# EAGLE schematic MPU-6050-HMC-5883 (EAGLE 6.2)
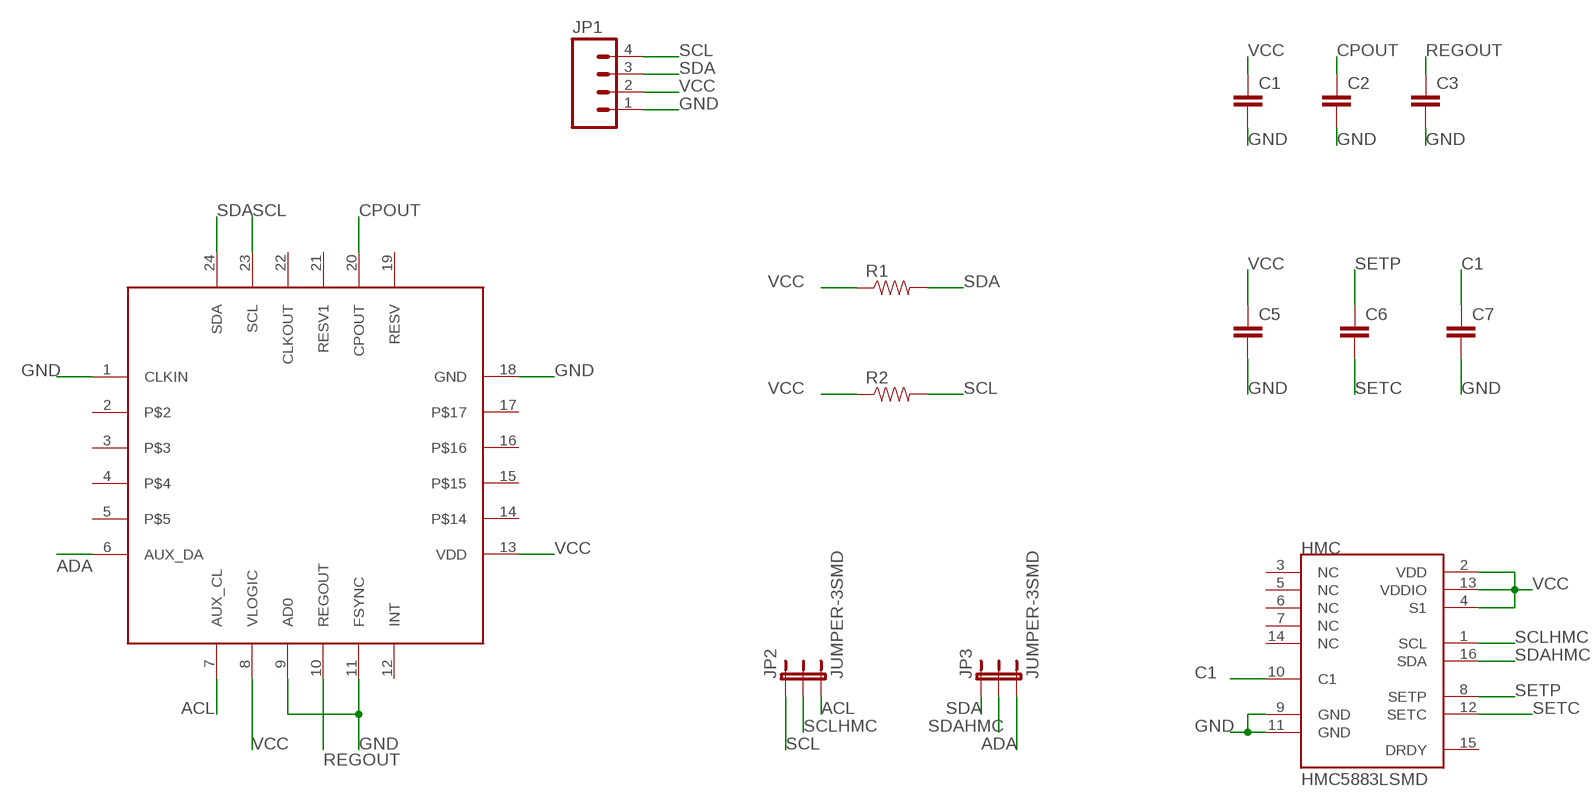
[diagram p0: schematic, sheet 1]

## Parts
C1  CAP0603-CAP  [0603-CAP]
C2  CAP0603-CAP  [0603-CAP]
C3  CAP0603-CAP  [0603-CAP]
C5  CAP0603-CAP  [0603-CAP]
C6  CAP0603-CAP  [0603-CAP]
C7  CAP0603-CAP  [0603-CAP]
HMC  HMC5883LSMD  [16LPCC]
JP1  M04PTH  [1X04]
JP2  JUMPER-3SMD  [SJ_3]
JP3  JUMPER-3SMD  [SJ_3]
MPU  MPU-6050  [QFN-24]
R1  RESISTOR0603-RES  [0603-RES]
R2  RESISTOR0603-RES  [0603-RES]

## Nets
ACL: JP2.3 MPU.7(AUX_CL)
ADA: JP3.3 MPU.6(AUX_DA)
C1: C7.1 HMC.10(C1)
CPOUT: C2.1 MPU.20(CPOUT)
GND: C1.2 C2.2 C3.2 C5.2 C7.2 HMC.9(GND) HMC.11(GND) JP1.1 MPU.1(CLKIN) MPU.9(AD0) MPU.11(FSYNC) MPU.18(GND)
REGOUT: C3.1 MPU.10(REGOUT)
SCL: JP1.4 JP2.1 MPU.23(SCL) R2.2
SCLHMC: HMC.1(SCL) JP2.2
SDA: JP1.3 JP3.1 MPU.24(SDA) R1.2
SDAHMC: HMC.16(SDA) JP3.2
SETC: C6.2 HMC.12(SETC)
SETP: C6.1 HMC.8(SETP)
VCC: C1.1 C5.1 HMC.2(VDD) HMC.4(S1) HMC.13(VDDIO) JP1.2 MPU.8(VLOGIC) MPU.13(VDD) R1.1 R2.1
Unconnected: HMC.3(NC) HMC.5(NC) HMC.6(NC) HMC.7(NC) HMC.14(NC) HMC.15(DRDY) MPU.2 MPU.3 MPU.4 MPU.5 MPU.12(INT) MPU.14 MPU.15 MPU.16 MPU.17 MPU.19(RESV) MPU.21(RESV1) MPU.22(CLKOUT)

## Library data of the parts
C1-C3 C5-C7 = SparkFun:CAP: Capacitor Standard 0603 ceramic capacitor, and 0.1" leaded capacitor.
HMC = SparkFun:HMC5883L: 3 Axis Digital Compass IC
JP1 = SparkFun:M04: Header 4 Standard 4-pin 0.1" header. Use with straight break away headers (SKU : PRT-00116), right angle break away headers (PRT-00553), swiss pins (PRT-00743), machine pins (PRT-00117), and female headers (PRT-00115). Molex polarized connector foot print use with SKU : PRT-08231 with associated crimp pins and housings. 1MM SMD Version SKU: PRT-10208
JP2 JP3 = SparkFun:JUMPER-3
MPU = MPU-6050:MPU-6050
R1 R2 = SparkFun:RESISTOR: Resistor Basic schematic elements and footprints for 0603, 1206, and PTH resistors.